# EAGLE design OpenStage (EAGLE 9.6.2)
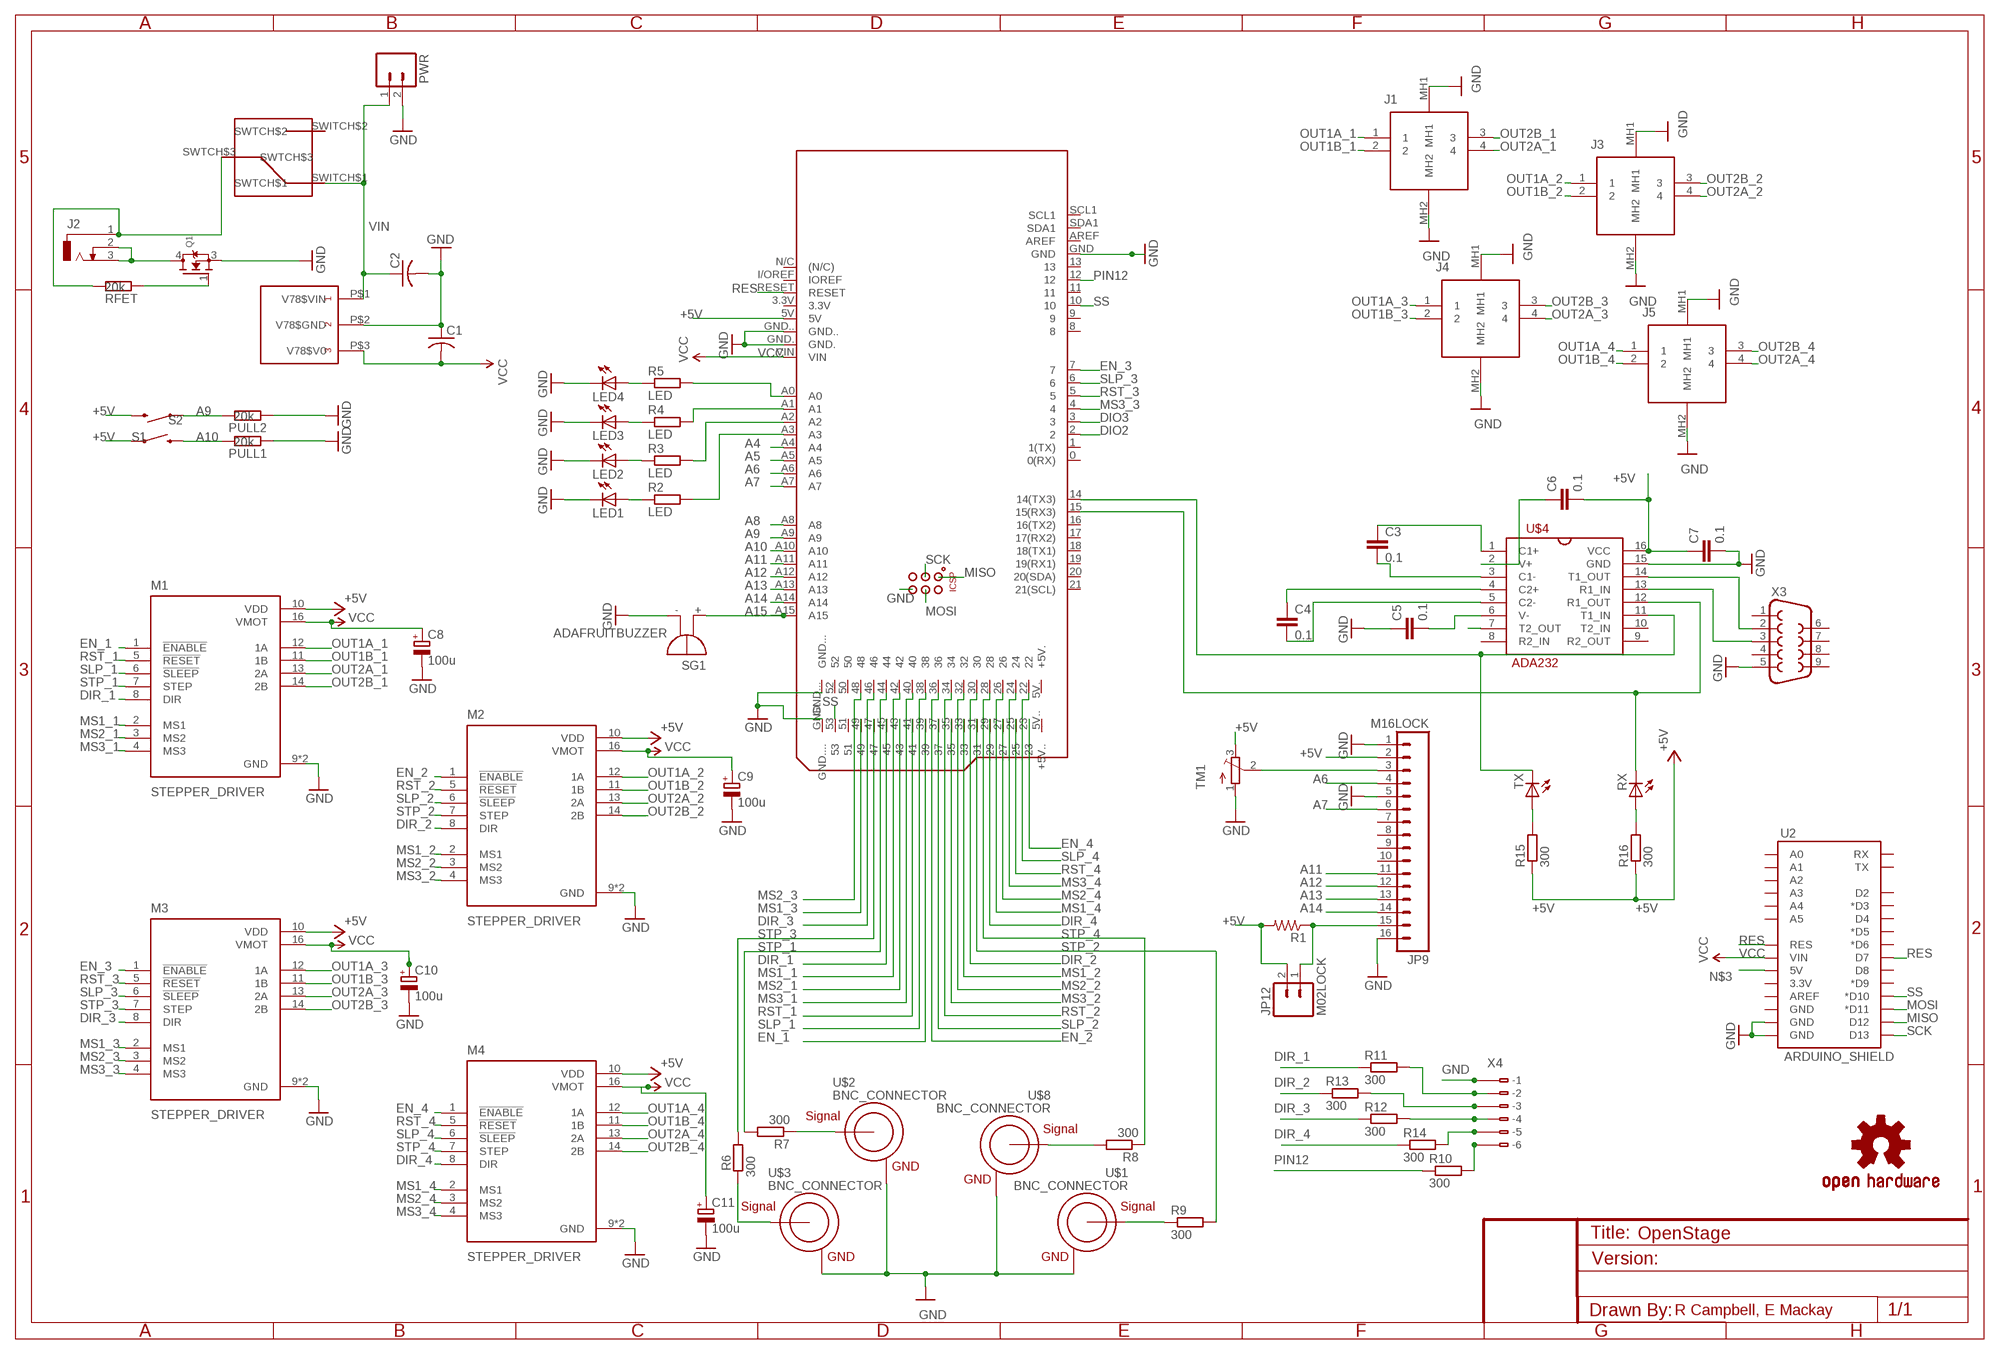
[diagram p0: schematic, sheet 1]

## Parts
C1  C-USC1210K  [C1210K]
C2  C-USC1210K  [C1210K]
C3  0.1  CAP_  [AXIAL-5MM]
C4  0.1  CAP_  [AXIAL-5MM]
C5  0.1  CAP_  [AXIAL-5MM]
C6  0.1  CAP_  [AXIAL-5MM]
C7  0.1  CAP_  [AXIAL-5MM]
C8  100u  CPOL-EUE2.5-5  [E2,5-5]
C9  100u  CPOL-EUE2.5-5  [E2,5-5]
C10  100u  CPOL-EUE2.5-5  [E2,5-5]
C11  100u  CPOL-EUE2.5-5  [E2,5-5]
J1  M8S-04PFFR-SF8001  [M8S04PFFRSF8001]
J2  DCJ0303  [DCJ0303]
J3  M8S-04PFFR-SF8001  [M8S04PFFRSF8001]
J4  M8S-04PFFR-SF8001  [M8S04PFFRSF8001]
J5  M8S-04PFFR-SF8001  [M8S04PFFRSF8001]
JP9  M16LOCK  [1X16_LOCK]
JP12  M02LOCK  [1X02_LOCK]
LED1  LED3MM  [LED3MM]
LED2  LED3MM  [LED3MM]
LED3  LED3MM  [LED3MM]
LED4  LED3MM  [LED3MM]
LOGO1  OSHW-LOGOL  [OSHW-LOGO-L]
M1  STEPPER_DRIVER  [POLOLU_CARRIER]
M2  STEPPER_DRIVER  [POLOLU_CARRIER]
M3  STEPPER_DRIVER  [POLOLU_CARRIER]
M4  STEPPER_DRIVER  [POLOLU_CARRIER]
PCB2  ARDUINO_MEGA_ROB  [ARDUINO_MEGA_ROB]
PULL1  20k  R-EU_R3216  [R3216]
PULL2  20k  R-EU_R3216  [R3216]
PWR  M02PTH  [1X02]
Q1  MOSFET-N_TO252  [TO252]
R1  R-US_0204/7  [0204/7]
R2  LED  R-EU_R3216  [R3216]
R3  LED  R-EU_R3216  [R3216]
R4  LED  R-EU_R3216  [R3216]
R5  LED  R-EU_R3216  [R3216]
R6  300  R-EU_R3216  [R3216]
R7  300  R-EU_R3216  [R3216]
R8  300  R-EU_R3216  [R3216]
R9  300  R-EU_R3216  [R3216]
R10  300  R-EU_R3216  [R3216]
R11  300  R-EU_R3216  [R3216]
R12  300  R-EU_R3216  [R3216]
R13  300  R-EU_R3216  [R3216]
R14  300  R-EU_R3216  [R3216]
R15  300  R-EU_R3216  [R3216]
R16  300  R-EU_R3216  [R3216]
RFET  20k  R-EU_R3216  [R3216]
RX  LED3MM  [LED3MM]
S1  SWITCH-MOMENTARY-212MM  [TACTILE-PTH-12MM]
S2  SWITCH-MOMENTARY-212MM  [TACTILE-PTH-12MM]
SG1  ADAFRUITBUZZER  [BMT1205XH7.5]
TM1  TRIMPOT3386  [TRIM-3386]
TX  LED3MM  [LED3MM]
U2  ARDUINO_SHIELD  ARDUINO_SHIELDNO_SILK  [DUEMILANOVE_VIAS]
U$1  BNC_CONNECTOR  [BNC_CONNECTOR]
U$2  BNC_CONNECTOR  [BNC_CONNECTOR]
U$3  BNC_CONNECTOR  [BNC_CONNECTOR]
U$4  ADA232  [DIL16]
U$5  V78XX-1000  [V78XX-1000]
U$6  SLIDING_SWITCH_0.185  [SLIDING_SWITCH_0.185]
U$8  BNC_CONNECTOR  [BNC_CONNECTOR]
X3  DB9FEMALE  [DB9]
X4  233-206  [233-206]

## Nets
+5V: C6.P$2 C7.P$1 JP9.2 JP12.2 M1.10(VDD) M2.10(VDD) M3.10(VDD) M4.10(VDD) PCB2.5V R1.2 R15.1 R16.1 S1.1 S2.3 TM1.3(E) U$4.16(VCC)
A4: PCB2.A4
A5: PCB2.A5
A6: JP9.4 PCB2.A6
A7: JP9.6 PCB2.A7
A8: PCB2.A8
A9: PCB2.A9 PULL2.2 S2.1
A10: PCB2.A10 PULL1.2 S1.3
A11: JP9.11 PCB2.A11
A12: JP9.12 PCB2.A12
A13: JP9.13 PCB2.A13
A14: JP9.14 PCB2.A14
A15: PCB2.A15 SG1.+
DIO2: PCB2.2
DIO3: PCB2.3
DIR_1: M1.8(DIR) PCB2.45 R11.1
DIR_2: M2.8(DIR) PCB2.30 R13.1
DIR_3: M3.8(DIR) PCB2.46 R12.1
DIR_4: M4.8(DIR) PCB2.29 R14.1
EN_1: M1.1(!ENABLE) PCB2.39
EN_2: M2.1(!ENABLE) PCB2.36
EN_3: M3.1(!ENABLE) PCB2.7
EN_4: M4.1(!ENABLE) PCB2.23
GND: C1.1 C2.2 C5.P$1 C7.P$2 C8.- C9.- C10.- C11.- J1.MH1 J1.MH2 J3.MH1 J3.MH2 J4.MH1 J4.MH2 J5.MH1 J5.MH2 JP9.1 JP9.5 JP9.16 LED1.K(C) LED2.K(C) LED3.K(C) LED4.K(C) M1.9(GND) M1.15(GND) M2.9(GND) M2.15(GND) M3.9(GND) M3.15(GND) M4.9(GND) M4.15(GND) PCB2.GND PCB2.GND. PCB2.GND.. PCB2.GND... PCB2.GND.... PCB2.GND__ PULL1.1 PULL2.1 PWR.2 Q1.3(S) SG1.- TM1.1(A) U2.GND@0(GND) U2.GND@1(GND) U$1.GND U$2.GND U$3.GND U$4.15(GND) U$5.P$2(V78$GND) U$8.GND X3.5 X4.B1(B-1)
MISO: PCB2.MISO U2.D12
MOSI: PCB2.MOSI U2.D11(*D11)
MS1_1: M1.2(MS1) PCB2.42
MS1_2: M2.2(MS1) PCB2.33
MS1_3: M3.2(MS1) PCB2.49
MS1_4: M4.2(MS1) PCB2.26
MS2_1: M1.3(MS2) PCB2.43
MS2_2: M2.3(MS2) PCB2.32
MS2_3: M3.3(MS2) PCB2.48
MS2_4: M4.3(MS2) PCB2.27
MS3_1: M1.4(MS3) PCB2.40
MS3_2: M2.4(MS3) PCB2.35
MS3_3: M3.4(MS3) PCB2.4
MS3_4: M4.4(MS3) PCB2.24
N$2: R7.1 U$2.SIGNAL
N$3: U2.5V
N$10: LED1.A R2.1
N$31: R9.1 U$1.SIGNAL
N$33: LED2.A R3.1
N$34: LED3.A R4.1
N$35: LED4.A R5.1
N$37: PCB2.A0 R5.2
N$38: PCB2.A1 R4.2
N$39: PCB2.A2 R3.2
N$40: PCB2.A3 R2.2
N$44: JP9.15 JP12.1 R1.1
N$60: PCB2.14(14(TX3)) TX.K(C) U$4.11(T1_IN)
N$61: PCB2.15(15(RX3)) RX.K(C) U$4.12(R1_OUT)
N$62: C3.P$1 U$4.1(C1+)
N$63: C3.P$2 U$4.3(C1-)
N$64: C4.P$1 U$4.4(C2+)
N$65: C5.P$2 U$4.6(V-)
N$66: C4.P$2 U$4.5(C2-)
N$67: C6.P$1 U$4.2(V+)
N$68: U$4.7(T2_OUT)
N$69: JP9.3 TM1.2(S)
N$70: U$4.13(R1_IN) X3.3
N$71: U$4.14(T1_OUT) X3.2
N$73: J2.1 RFET.2 U$6.SWTCH$3
N$74: R8.2 U$8.SIGNAL
N$75: R6.1 U$3.SIGNAL
N$77: R11.2 X4.A2(-2) X4.B2(B-2)
N$78: R12.2 X4.A4(-4) X4.B4(B-4)
N$79: R13.2 X4.B3(B-3)
N$80: R14.2 X4.B5(B-5)
N$81: R10.2 X4.B6(B-6)
N$82: R15.2 TX.A
N$83: R16.2 RX.A
N$84: J2.2 J2.3 Q1.4(D)
N$85: Q1.1(G) RFET.1
OUT1A_1 [thick]: J1.1 M1.12(1A)
OUT1A_2 [thick]: J3.1 M2.12(1A)
OUT1A_3 [thick]: J4.1 M3.12(1A)
OUT1A_4 [thick]: J5.1 M4.12(1A)
OUT1B_1 [thick]: J1.2 M1.11(1B)
OUT1B_2 [thick]: J3.2 M2.11(1B)
OUT1B_3 [thick]: J4.2 M3.11(1B)
OUT1B_4 [thick]: J5.2 M4.11(1B)
OUT2A_1 [thick]: J1.4 M1.13(2A)
OUT2A_2 [thick]: J3.4 M2.13(2A)
OUT2A_3 [thick]: J4.4 M3.13(2A)
OUT2A_4 [thick]: J5.4 M4.13(2A)
OUT2B_1 [thick]: J1.3 M1.14(2B)
OUT2B_2 [thick]: J3.3 M2.14(2B)
OUT2B_3 [thick]: J4.3 M3.14(2B)
OUT2B_4 [thick]: J5.3 M4.14(2B)
PIN12: PCB2.12 R10.1
RES: PCB2.RESET U2.D7 U2.RES
RST_1: M1.5(!RESET) PCB2.41
RST_2: M2.5(!RESET) PCB2.34
RST_3: M3.5(!RESET) PCB2.5
RST_4: M4.5(!RESET) PCB2.25
SCK: PCB2.SCK U2.D13
SLP_1: M1.6(!SLEEP) PCB2.38
SLP_2: M2.6(!SLEEP) PCB2.37
SLP_3: M3.6(!SLEEP) PCB2.6
SLP_4: M4.6(!SLEEP) PCB2.22
SS: PCB2.10 PCB2.53 U2.D10(*D10)
STP_1: M1.7(STEP) PCB2.44 R7.2
STP_2: M2.7(STEP) PCB2.31 R9.2
STP_3: M3.7(STEP) PCB2.47 R6.2
STP_4: M4.7(STEP) PCB2.28 R8.1
VCC [thicker]: C1.2 C8.+ C9.+ C10.+ C11.+ M1.16(VMOT) M2.16(VMOT) M3.16(VMOT) M4.16(VMOT) PCB2.VIN U2.VIN U$5.P$3(V78$V0)
VIN: C2.1 PWR.1 U$5.P$1(V78$VIN) U$6.SWITCH$1(SWTCH$1)
Unconnected: JP9.7 JP9.8 JP9.9 JP9.10 PCB2.0(0(RX)) PCB2.1(1(TX)) PCB2.3.3V PCB2.5V.(+5V.) PCB2.5V..(+5V..) PCB2.8 PCB2.9 PCB2.11 PCB2.13 PCB2.16(16(TX2)) PCB2.17(17(RX2)) PCB2.18(18(TX1)) PCB2.19(19(RX1)) PCB2.20(20(SDA)) PCB2.21(21(SCL)) PCB2.50 PCB2.51 PCB2.52 PCB2.+5V_ PCB2.AREF PCB2.I/OREF(IOREF) PCB2.N/C((N/C)) PCB2.RESET. PCB2.SCL1 PCB2.SDA1 U2.3.3V U2.A0 U2.A1 U2.A2 U2.A3 U2.A4 U2.A5 U2.AREF U2.D2 U2.D3(*D3) U2.D4 U2.D5(*D5) U2.D6(*D6) U2.D8 U2.D9(*D9) U2.GND@2(GND) U2.RX U2.TX U$4.8(R2_IN) U$4.9(R2_OUT) U$4.10(T2_IN) U$6.SWITCH$2(SWTCH$2) X3.1 X3.4 X3.6 X3.7 X3.8 X3.9 X4.A1(-1) X4.A3(-3) X4.A5(-5) X4.A6(-6)

## Notes on the sheet
- R Campbell, E Mackay

## Library data of the parts
C1 C2 = rcl:C-US: CAPACITOR, American symbol
C3-C7 = SparkFun-Passives:CAP: Capacitor Standard 0603 ceramic capacitor, and 0.1" leaded capacitor.
C8-C11 = rcl:CPOL-EU: POLARIZED CAPACITOR, European symbol; SPICEPREFIX: C
J1 J3-J5 = SamacSys_Parts:M8S-04PFFR-SF8001: AMPHENOL LTW - M8S-04PFFR-SF8001 - SENSOR CONNECTOR, M8, RCPT, 4POS Source: Datasheet <http://www.amphenolltw.com/2012download/2D PDF/03_M Series Sensor Connectors/M8S-XXPFFR-SF8001.pdf>; DESCRIPTION: AMPHENOL LTW - M8S-04PFFR-SF8001 - SENSOR CONNECTOR, M8, RCPT, 4POS; HEIGHT: 16mm; MANUFACTURER_NAME: Amphenol; MANUFACTURER_PART_NUMBER: M8S-04PFFR-SF8001; MOUSER_PART_NUMBER: 523-M8S04PFFRSF8001; MOUSER_PRICE-STOCK: https://www.mouser.co.uk/ProductDetail/Amphenol-LTW/M8S-04PFFR-SF8001?qs=Wmhir8UuqEnwzMxObWTBkA%3D%3D
J2 = ROB:DCJ0303: DC POWER JACK Source: DCJ0303.pdf; OC_FARNELL: unknown; OC_NEWARK: unknown
JP9 = SparkFun-Connectors:M16: 1x16 .1" header
JP12 = SparkFun-Connectors:M02: Standard 2-pin 0.1" header. Use with - straight break away headers ( PRT-00116) - right angle break away headers (PRT-00553) - swiss pins (PRT-00743) - machine pins (PRT-00117) - female headers (PRT-00115) Molex polarized connector foot print use with: PRT-08233 with associated crimp pins and housings. 2.54_SCREWTERM for use with PRT-10571. 3.5mm Screw Terminal footprints for PRT-08084 5mm Screw Terminal footprints for use with PRT-08433
LED1-LED4 RX TX = adafruit:LED: LED OSRAM: - CHIPLED LG R971, LG N971, LY N971, LG Q971, LY Q971, LO R971, LY R971 LH N974, LH R974 LS Q976, LO Q976, LY Q976 LO Q996 - Hyper CHIPLED LW Q18S LB Q993, LB Q99A, LB R99A - SideLED LS A670, LO A670, LY A670, LG A670, LP A670 LB A673, LV A673, LT A673, LW A673 LH A674 LY A675 LS A676, LA A676, LO A676, LY A676, LW A676 LS A679, LY A679, LG A679 - Hyper Micro SIDELED® LS Y876, LA Y876, LO Y876, LY Y876 LT Y87S - SmartLED LW L88C, LW L88S LB L89C, LB L89S, LG L890 LS L89K, LO L89K, LY L89K LS L896, LA L896, LO L896, LY L896 - TOPLED LS T670, LO T670, LY T670, LG T670, LP T670 LSG T670, LSP T670, LSY T670, LOP T670, LYG T670 LG T671, LOG T671, LSG T671 LB T673, LV T673, LT T673, LW T673 LH T674 LS T676, LA T676, LO T676, LY T676, LB T676, LH T676, LSB T676, LW T676 LB T67C, LV T67C, LT T67C, LS T67K, LO T67K, LY T67K, LW E67C LS E67B, LA E67B, LO E67B, LY E67B, LB E67C, LV E67C, LT E67C LW T67C LS T679, LY T679, LG T679 LS T770, LO T770, LY T770, LG T770, LP T770 LB T773, LV T773, LT T773, LW T773 LH T774 LS E675, LA E675, LY E675, LS T675 LS T776, LA T776, LO T776, LY T776, LB T776 LHGB T686 LT T68C, LB T68C - Hyper Mini TOPLED® LB M676 - Mini TOPLED Santana® LG M470 LS M47K, LO M47K, LY M47K Source: http://www.osram.convergy.de/
LOGO1 = SparkFun-Aesthetics:OSHW-LOGO: Open Source Hardware Logo This logo indicates the piece of hardware it is found on incorporates a OSHW license and/or adheres to the definition of open source hardware found here: http://freedomdefined.org/OSHW
M1-M4 = A4988_STEPPER_MOTOR_DRIVER_CARRIER:STEPPER_DRIVER: Stepper motor controler; IC: A4988; 1A; Uin mot: 8÷35V; AVAILABILITY: Unavailable; DESCRIPTION: Stepper Motor Driver; MF: Pololu; MP: A4988 STEPPER MOTOR DRIVER CARRIER; PACKAGE: None; PRICE: None
PCB2 = ROB:ARDUINO_MEGA_ROB: Device for representing an Arduino Mega board with a footprint in an EAGLE design. Created by Dave Young for Element14. More EAGLE documentation at: http://www.element14.com/community/community/knode/cadsoft_eagle Drill holes removed
PULL1 PULL2 R2-R16 RFET = resistor:R-EU_: RESISTOR, European symbol
PWR = SparkFun:M02: Header 2 Standard 2-pin 0.1" header. Use with straight break away headers (SKU : PRT-00116), right angle break away headers (PRT-00553), swiss pins (PRT-00743), machine pins (PRT-00117), and female headers (PRT-00115). Molex polarized connector foot print use with SKU : PRT-08233 with associated crimp pins and housings.
Q1 = ROB:MOSFET-N_TO252: N-Channel Mosfet NP90N06VLG
R1 = resistor:R-US_: RESISTOR, American symbol
S1 S2 = SparkFun-Electromechanical:SWITCH-MOMENTARY-2: Various NO switches- pushbuttons, reed, etc; PROD_ID: SWCH-09185
SG1 = ROB:ADAFRUITBUZZER: AdaFruit Buzzer TDK
TM1 = adafruit:TRIMPOT: SMT trimmer potentiometer part number TC33X http://www.ladyada.net/library/eagle
U2 = SparkFun-Boards:ARDUINO_SHIELD: Arduino shield footprint
U$1-U$3 U$8 = JoshParts:BNC_CONNECTOR
U$4 = ROB:ADA232
U$5 = ROB:V78XX-1000: V78XX-1000 non-isolated switching DC/DC voltage regulator cui.com
U$6 = ROB:SLIDING_SWITCH_0.185
X3 = SparkFun-Connectors:DB9: DB9 Connector Standard DB9 (D-Sub 9) serial connector. Can be used for CAN bus as well as RS485 and RS232. Footprint production proven. Spark Fun Electronics SKU : PRT-00429
X4 = con-wago:233-206: WAGO Cage Clamp; MPN: 233-206; OC_FARNELL: 1283536; OC_NEWARK: 28K9063

## Net classes
0 default: width 0.2 mm
1 thick: width 0.3 mm, drill 0.003 mm, clearance 0.1 mm
2 thicker: width 0.5 mm

## Board
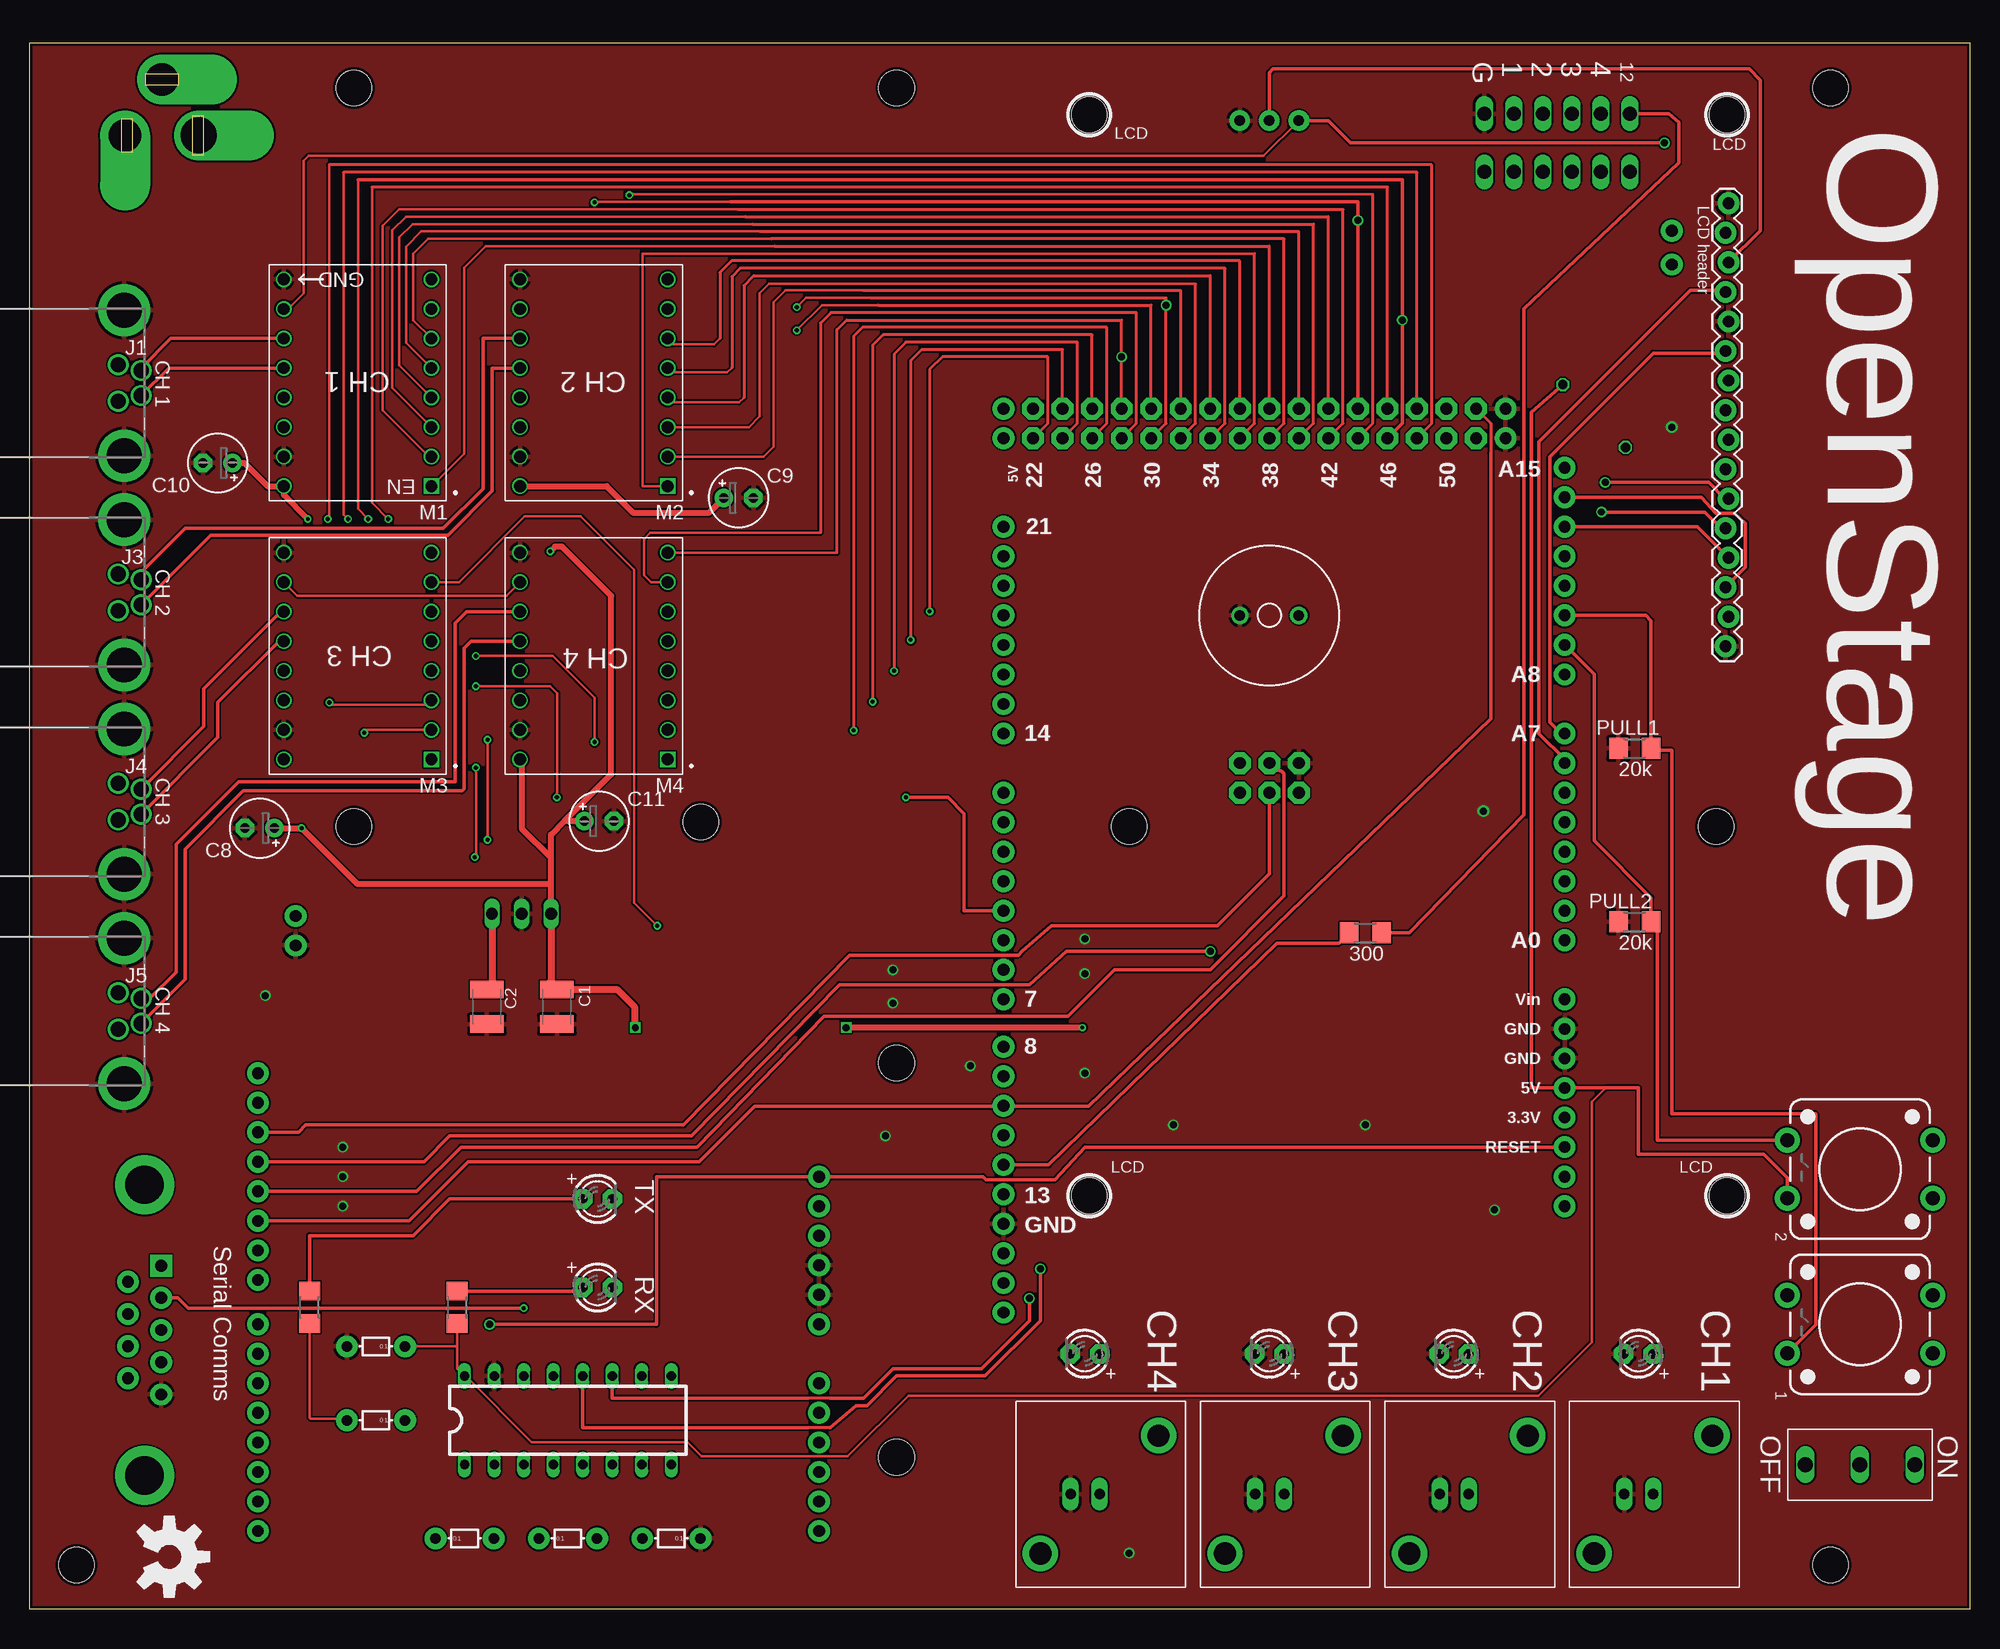
[diagram p1: board, top side]
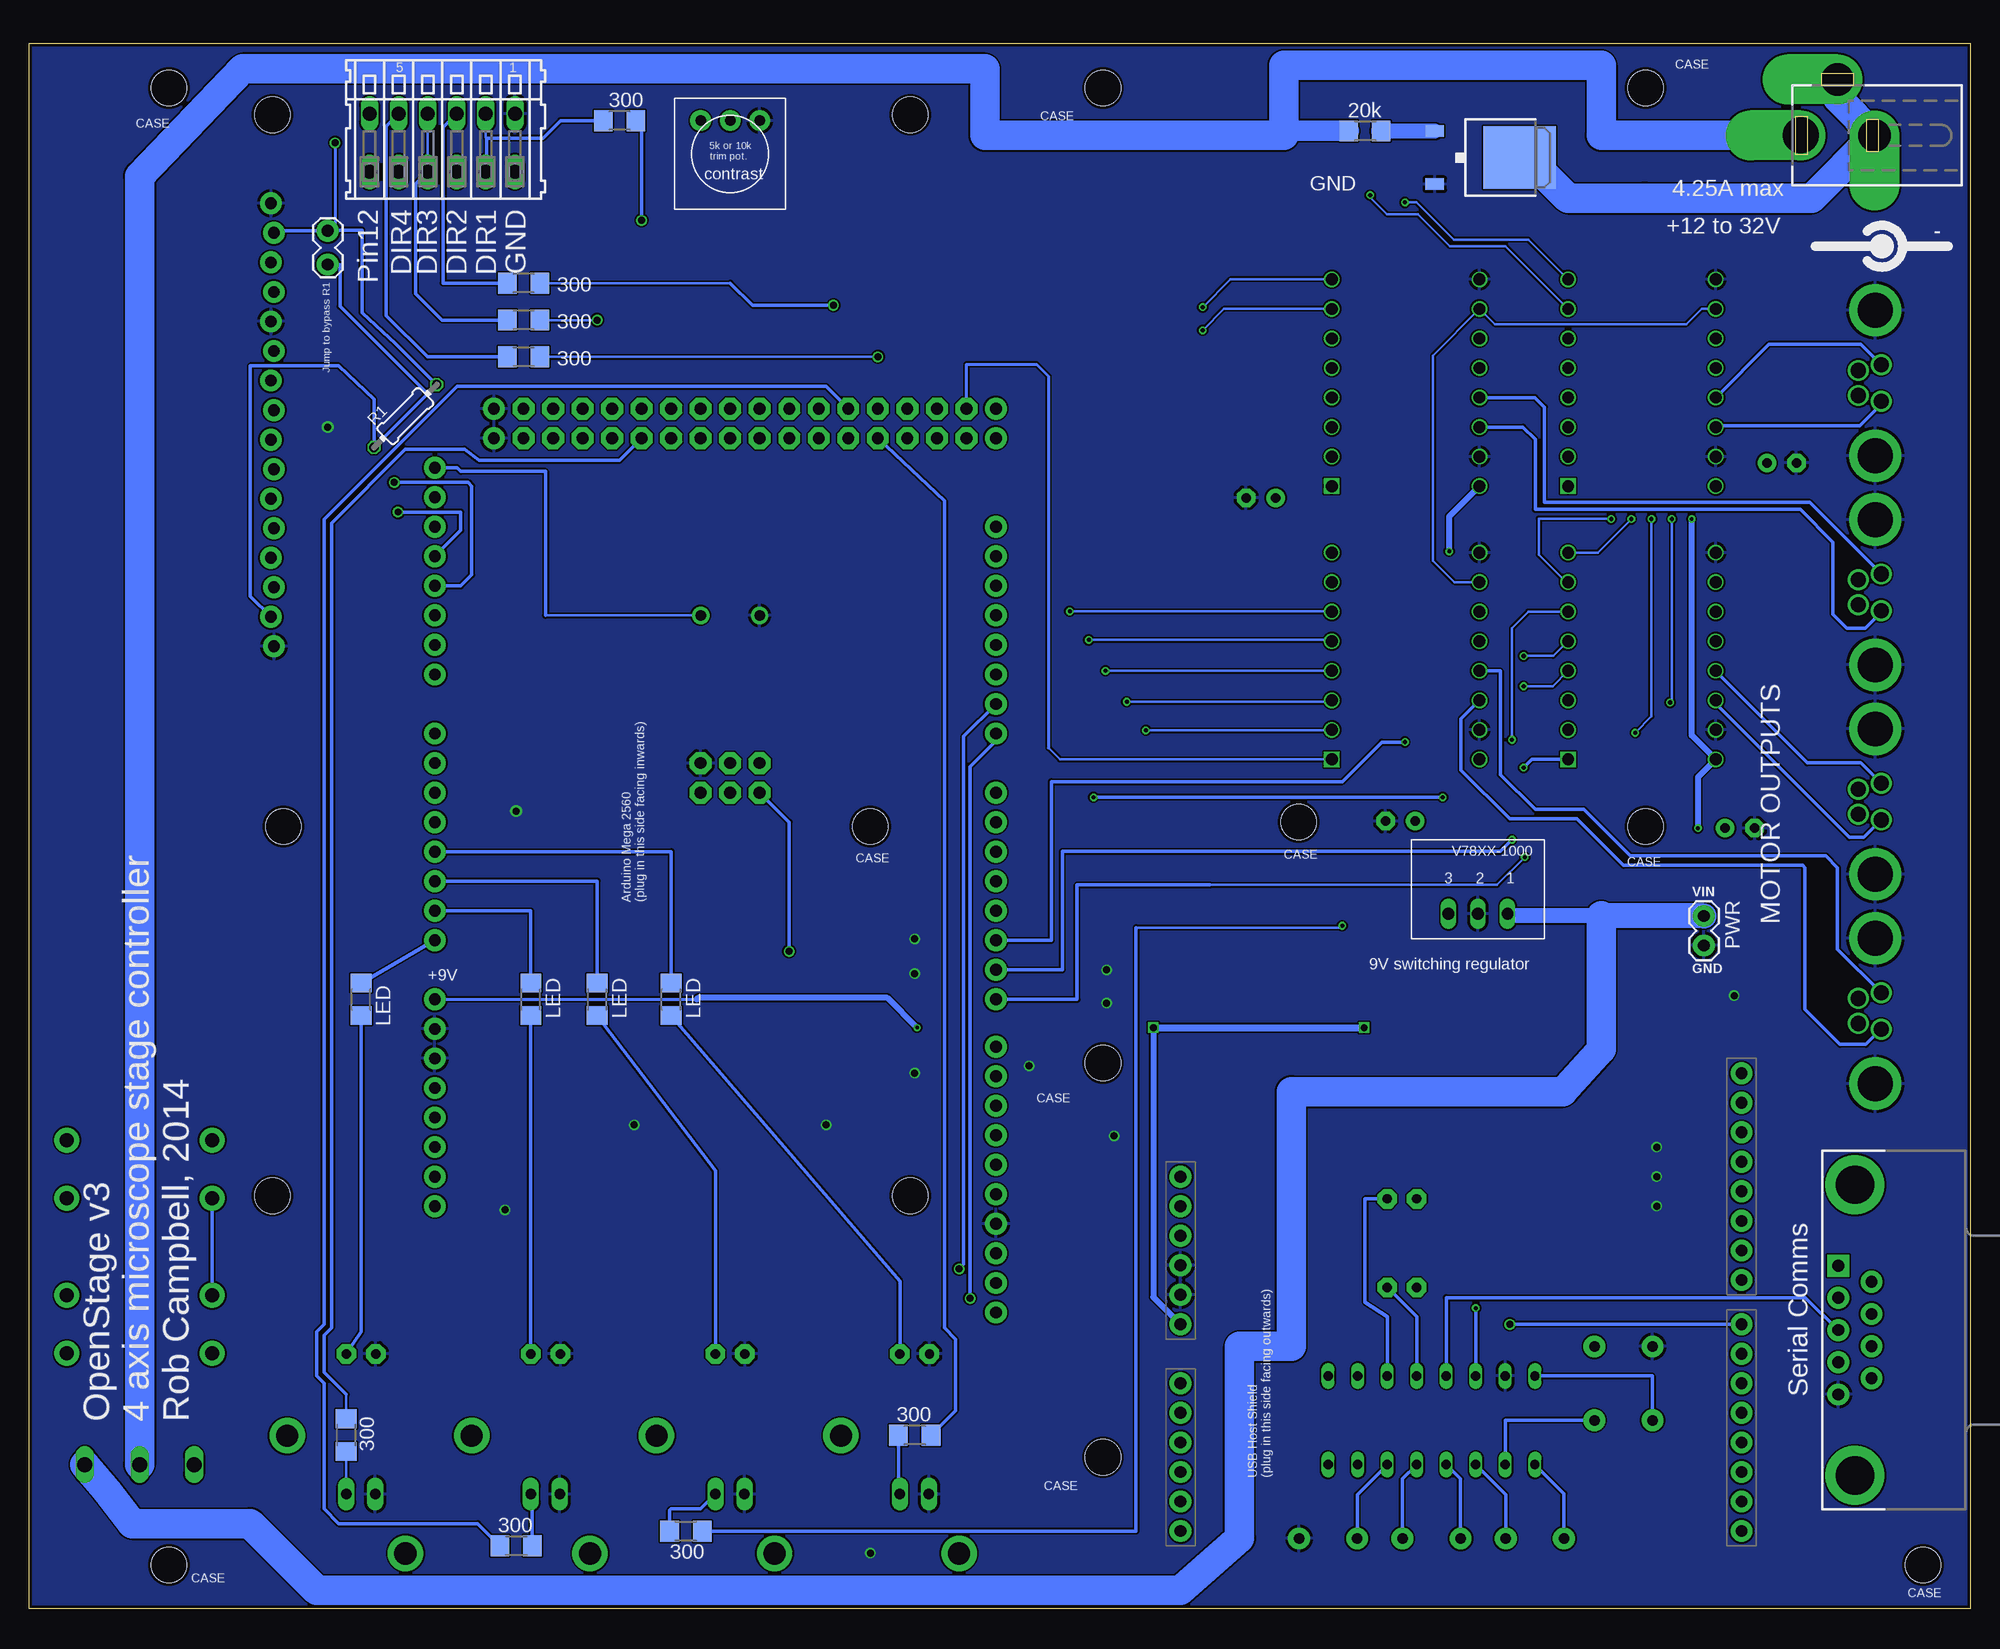
[diagram p2: board, bottom side, seen from below]

Size 166.98 x 134.61 mm. Coordinates in mm from the lower left corner, seen from the top.
Outline: 0,0 166.98,0 166.98,134.61 0,134.61 0,0
Copper layers (1*16): Top 0.035mm / dielectric 0.2mm / Bottom 0.035mm
Design rules "SeeedStudio_DRU_no_angle_20130527 *": minimum track width 6mil, minimum drill 12mil, track to track 6mil, track to pad 6mil, pad to pad 6mil, via to via 6mil, smd to smd 0mil, copper to edge 10mil, drill to drill 10mil, minimum pad ring 6mil, minimum via ring 6mil, stop-mask expansion 2mil, vias tented up to drill 25mil, thermal gap 10mil
Holes 3.05 mm at 146.05,35.5 91.19,128.46 91.19,35.5 146.05,128.46 154.94,3.75 74.61,13.02 27.94,67.25 4.06,3.75 27.94,130.75 74.61,130.75 154.94,130.75 74.61,46.93 94.62,67.25 57.78,67.63 145.1,67.25

### Footprints (pad centres in the part's own frame; a part is rotated, then mirrored left to right if it is on the bottom)
C1210K = smd 1.5 x 2.9: 1 -1.5,0; 2 1.5,0
AXIAL-5MM = drill 0.9 pad 1.88: P$1 -2.5,0; P$2 2.5,0
E2,5-5 = drill 0.813 pad 1.6: + -1.27,0 | drill 0.813 pad 1.6 octagon: - 1.27,0
M8S04PFFRSF8001 = drill 1.3 pad 1.8: 1 0,0; 2 2.15,0; 3 -0.5,1.95; 4 2.65,1.95 | drill 3 pad 4.5: MH1 -5.175,1.45; MH2 7.325,1.45
DCJ0303 = drill 3.099 pad 4.318 offset: 1 0,3.175 | drill 2.794 pad 4.318 offset: 2 4.826,0; 3 0,-3.175
1X16_LOCK = drill 1.016 pad 1.88: 1 0,0.127; 2 2.54,-0.127; 3 5.08,0.127; 4 7.62,-0.127; 5 10.16,0.127; 6 12.7,-0.127; 7 15.24,0.127; 8 17.78,-0.127; 9 20.32,0.127; 10 22.86,-0.127; 11 25.4,0.127; 12 27.94,-0.127; 13 30.48,0.127; 14 33.02,-0.127; 15 35.56,0.127; 16 38.1,-0.127
1X02_LOCK = drill 1.016 pad 1.88: 1 -0.178,0; 2 2.718,0
LED3MM = drill 0.813 pad 1.676 octagon: A -1.27,0; K 1.27,0
POLOLU_CARRIER = drill 1.02 square: 1 -6.35,8.89 | drill 1.02: 2 -6.35,6.35; 3 -6.35,3.81; 4 -6.35,1.27; 5 -6.35,-1.27; 6 -6.35,-3.81; 7 -6.35,-6.35; 8 -6.35,-8.89; 9 6.35,-8.89; 10 6.35,-6.35; 11 6.35,-3.81; 12 6.35,-1.27; 13 6.35,1.27; 14 6.35,3.81; 15 6.35,6.35; 16 6.35,8.89
ARDUINO_MEGA_ROB = drill 1.016 pad 1.88: 0 63.5,50.8; 1 60.96,50.8; 2 58.42,50.8; 3 55.88,50.8; 3.3V 35.56,2.54; 4 53.34,50.8; 5 50.8,50.8; 5V 38.1,2.54; 5V. 93.98,50.8; 5V.. 96.52,50.8; 6 48.26,50.8; 7 45.72,50.8; 8 41.656,50.8; 9 39.116,50.8; 10 36.576,50.8; 11 34.036,50.8; 12 31.496,50.8; 13 28.956,50.8; 14 68.58,50.8; 15 71.12,50.8; 16 73.66,50.8; 17 76.2,50.8; 18 78.74,50.8; 19 81.28,50.8; 20 83.82,50.8; 21 86.36,50.8; A0 50.8,2.54; A1 53.34,2.54; A2 55.88,2.54; A3 58.42,2.54; A4 60.96,2.54; A5 63.5,2.54; A6 66.04,2.54; A7 68.58,2.54; A8 73.66,2.54; A9 76.2,2.54; A10 78.74,2.54; A11 81.28,2.54; A12 83.82,2.54; A13 86.36,2.54; A14 88.9,2.54; A15 91.44,2.54; AREF 23.876,50.8; GND 26.416,50.8; GND. 43.18,2.54; GND.. 40.64,2.54; GND... 93.98,7.62; GND.... 96.52,7.62; I/OREF 30.48,2.54; N/C 27.94,2.54; RESET 33.02,2.54; SCL1 18.796,50.8; SDA1 21.336,50.8; VIN 45.72,2.54 | drill 1.016 pad 1.88 octagon: 22 93.98,48.26; 23 96.52,48.26; 24 93.98,45.72; 25 96.52,45.72; 26 93.98,43.18; 27 96.52,43.18; 28 93.98,40.64; 29 96.52,40.64; 30 93.98,38.1; 31 96.52,38.1; 32 93.98,35.56; 33 96.52,35.56; 34 93.98,33.02; 35 96.52,33.02; 36 93.98,30.48; 37 96.52,30.48; 38 93.98,27.94; 39 96.52,27.94; 40 93.98,25.4; 41 96.52,25.4; 42 93.98,22.86; 43 96.52,22.86; 44 93.98,20.32; 45 96.52,20.32; 46 93.98,17.78; 47 96.52,17.78; 48 93.98,15.24; 49 96.52,15.24; 50 93.98,12.7; 51 96.52,12.7; 52 93.98,10.16; 53 96.52,10.16; +5V_ 66.04,30.48; GND__ 66.04,25.4; MISO 63.5,30.48; MOSI 66.04,27.94; RESET. 63.5,25.4; SCK 63.5,27.94
R3216 = smd 1.6 x 1.8: 1 -1.4,0; 2 1.4,0
1X02 = drill 1.016 pad 1.88: 1 0,0; 2 2.54,0
TO252 = smd 1 x 1.6: 1 -2.28,-4.8; 3 2.28,-4.8 | smd 5.4 x 6.2: 4 0,2.5
0204/7 = drill 0.813 octagon: 1 -3.81,0; 2 3.81,0
TACTILE-PTH-12MM = drill 1.2 pad 2.159: 1 6.25,-2.5; 2 -6.25,-2.5; 3 6.25,2.5; 4 -6.25,2.5
BMT1205XH7.5 = drill 0.9 pad 1.5: + 2.53,0; - -2.53,0
TRIM-3386 = drill 0.9 pad 1.778: 1 -2.54,-2.857; 2 0,-2.857; 3 2.54,-2.857
DUEMILANOVE_VIAS = drill 1.016 pad 1.88: 3.3V 50.8,13.97; 5V 50.8,16.51; A0 50.8,29.21; A1 50.8,31.75; A2 50.8,34.29; A3 50.8,36.83; A4 50.8,39.37; A5 50.8,41.91; AREF 2.54,2.54; D2 2.54,36.83; D3 2.54,34.29; D4 2.54,31.75; D5 2.54,29.21; D6 2.54,26.67; D7 2.54,24.13; D8 2.54,20.32; D9 2.54,17.78; D10 2.54,15.24; D11 2.54,12.7; D12 2.54,10.16; D13 2.54,7.62; GND@0 50.8,19.05; GND@1 50.8,21.59; GND@2 2.54,5.08; RES 50.8,11.43; RX 2.54,41.91; TX 2.54,39.37; VIN 50.8,24.13
BNC_CONNECTOR = drill 0.9 pad 1.422 long: GND -2.492,0; SIGNAL 0,0 | drill 1.9 pad 3.048: P$3 5.076,5.025; P$4 -5.089,-5.102
DIL16 = drill 0.813 long: 1 -8.89,-3.81; 2 -6.35,-3.81; 3 -3.81,-3.81; 4 -1.27,-3.81; 5 1.27,-3.81; 6 3.81,-3.81; 7 6.35,-3.81; 8 8.89,-3.81; 9 8.89,3.81; 10 6.35,3.81; 11 3.81,3.81; 12 1.27,3.81; 13 -1.27,3.81; 14 -3.81,3.81; 15 -6.35,3.81; 16 -8.89,3.81
V78XX-1000 = drill 1.016 long: P$1 3.302,6.604; P$2 5.842,6.604; P$3 8.382,6.604
SLIDING_SWITCH_0.185 = drill 1.295 long: SWITCH$1 -4.699,0; SWITCH$2 4.699,0; SWTCH$3 0,0
DB9 = drill 1.016 pad 1.88 square: 1 -5.54,-1.42 | drill 1.016 pad 1.88: 2 -2.77,-1.42; 3 0,-1.42; 4 2.77,-1.42; 5 5.54,-1.42; 6 -4.15,1.42; 7 -1.38,1.42; 8 1.38,1.42; 9 4.15,1.42 | drill 3.302 pad 5.08: G1 -12.5,0; G2 12.5,0
233-206 = drill 1.2 long: A1 -6.25,2.5; A2 -3.75,2.5; A3 -1.25,2.5; A4 1.25,2.5; A5 3.75,2.5; A6 6.25,2.5; B1 -6.25,-2.5; B2 -3.75,-2.5; B3 -1.25,-2.5; B4 1.25,-2.5; B5 3.75,-2.5; B6 6.25,-2.5

### Placement (x,y rotation side)
C1  45.4,51.75 90 top
C2  39.37,51.75 270 top
C3  37.46,6.03 0 top
C4  46.35,6.03 0 top
C5  55.24,6.03 180 top
C6  29.85,16.19 180 top
C7  29.85,22.54 180 top
C8  19.84,67.12 180 top
C9  61.03,95.52 0 top
C10  16.23,98.52 180 top
C11  49.03,67.72 0 top
J1  9.63,104.32 90 top
J2  11.43,126.68 90 bottom
J3  9.63,86.32 90 top
J4  9.63,68.32 90 top
J5  9.63,50.32 90 top
JP9  146.05,120.84 270 top
JP12  141.29,115.76 90 bottom
LED1  90.81,21.91 180 top
LED2  106.68,21.91 180 top
LED3  122.56,21.91 180 top
LED4  138.43,21.91 180 top
LOGO1  12.06,4.45 270 top
M1  28.26,105.41 180 top
M2  48.58,105.41 180 top
M3  28.26,81.91 180 top
M4  48.58,81.91 180 top
PCB2  134.62,6.67 90 top
PULL1  138.11,73.98 0 top
PULL2  138.11,59.05 0 top
PWR  22.92,59.56 270 bottom
Q1  41.27,124.78 270 bottom
R1  134.62,102.55 45 bottom
R2  111.76,52.39 90 bottom
R3  118.11,52.39 90 bottom
R4  123.83,52.39 90 bottom
R5  138.43,52.39 90 bottom
R6  110.49,6.67 0 bottom
R7  139.7,14.92 90 bottom
R8  90.81,14.92 180 bottom
R9  125.09,5.4 180 bottom
R10  114.94,58.1 0 top
R11  116.2,127.95 180 bottom
R12  124.46,110.81 180 bottom
R13  124.46,113.98 180 bottom
R14  124.46,107.63 180 bottom
R15  24.13,25.91 90 top
R16  36.83,25.91 90 top
RFET  52.07,127.06 180 bottom
RX  48.89,27.62 0 top
S1  157.48,24.45 180 top
S2  157.48,37.78 180 top
SG1  106.68,85.41 0 top
TM1  106.68,125.09 180 bottom
TX  48.89,35.24 0 top
U2  17.15,48.58 180 bottom
U$1  123.83,9.84 0 top
U$2  139.7,9.84 0 top
U$3  107.95,9.84 0 top
U$4  46.35,16.19 0 top
U$5  36.51,66.36 180 bottom
U$6  157.48,12.38 180 top
U$8  92.08,9.84 0 top
X3  9.93,23.95 270 bottom
X4  131.44,126.05 180 bottom

### Tracks (layer width: path | path; a pad name or v marks a point on that pad's centre or on a via)
+5V  (via drill 0.6)
  Top 0.2: TM1.3 106.19,124.92 24.04,124.92 23.64,124.52 23.64,113.12 22.28,111.76 M1.10 | M3.10 23.06,87.12 41.08,87.12 M4.10 | 135.63,44.77 134.44,43.57 134.44,22.92 129.83,18.32 75.64,18.32 70.41,13.1 67.45,13.1 67.43,13.12 57.84,13.12 56.63,14.32 43.23,14.32 37.55,20 U$4.16 36.83,20.64 36.83,22.52 | C6.P$2 27.22,16.32 24.24,16.32 24.13,16.42 R15.1 | 36.83,22.52 R16.1 | C7.P$1 36.8,22.54 36.83,22.52
  Top 0.3: 129.22,44.77 PCB2.5V 135.63,44.77 138.43,44.77
  Top 0.305: 129.22,44.77 129.22,102.87 R1.2 | S2.3 151.23,37.05 149.22,39.05 138.43,39.05 138.43,44.77 | TM1.3 111.76,127.95 113.67,126.05 v140.67,126.05
  Bottom 0.2: M1.10 23.11,111.76 24.43,110.45 40.91,110.45 M2.10 46.23,107.75 46.23,90.12 44.38,88.27 M4.10
  Bottom 0.254: v140.67,126.05 140.64,126.02 140.64,118.74 140.64,118.55
  Bottom 0.305: S1.1 S2.3 | R1.2 135.45,108.78 138.34,111.44 138.34,118.55 140.64,118.55 | 140.64,118.74 141.02,118.74 JP12.2 145.75,118.48 JP9.2 | U$4.16 27.36,20 C6.P$2
A6
  Top 0.305: PCB2.A6 132.08,73.02 129.86,75.25 129.86,100.33 142.88,113.35 145.8,113.35 JP9.4
A7
  Top 0.305: PCB2.A7 131.76,75.25 130.81,76.2 130.81,99.06 139.7,107.95 145.73,107.95 JP9.6
A9
  Top 0.305: S2.1 140.06,40.28 140.06,58.51 PULL2.2 139.51,61.15 134.62,66.04 134.62,80.33 PCB2.A9
A10
  Top 0.305: PCB2.A10 139.06,85.41 139.51,84.96 PULL1.2 139.7,73.79 141.29,73.79 141.29,42.54 153.67,42.54 153.67,24.39 S1.3
A11  (via drill 0.6)
  Top 0.305: JP9.11 145.86,95.44 144.46,96.84 v135.57,96.84
  Bottom 0.305: PCB2.A11 129.86,87.95 128.91,88.9 128.91,96.52 129.22,96.84 v135.57,96.84
A12  (via drill 0.6)
  Top 0.305: JP9.12 145.54,92.9 144.14,94.3 v135.25,94.3
  Bottom 0.305: PCB2.A12 129.86,92.71 129.86,94.3 v135.25,94.3
A13
  Top 0.305: PCB2.A13 143.51,93.03 JP9.13
A14
  Top 0.305: PCB2.A14 143.83,95.57 145.1,94.17 146.69,94.17 147.64,93.35 147.64,89.54 JP9.14
A15
  Bottom 0.2: 122.56,85.41 SG1.+
  Bottom 0.305: 122.56,85.41 122.56,97.79 129.86,97.79 130.17,98.11 PCB2.A15
DIR_1  (via drill 0.35, 0.6)
  Top 0.2: v48.63,120.92 48.68,120.97 60.32,120.97
  Top 0.305: PCB2.45 v114.3,119.38 114.3,120.97 60.32,120.97
  Bottom 0.2: M1.8 38.02,117.72 44.43,117.72 47.63,120.92 v48.63,120.92 | R11.1 114.3,127.95
  Bottom 0.305: 114.3,127.95 v114.3,119.38
DIR_2  (via drill 0.35, 0.6)
  Top 0.2: v66.04,111.92 66.83,112.71 72.39,112.71
  Top 0.254: PCB2.30 97.79,101.92 v97.79,112.08 97.79,112.71 72.39,112.71
  Bottom 0.2: M2.8 63.65,114.3 v66.04,111.92 | R13.1 106.68,113.98
  Bottom 0.305: 106.68,113.98 104.78,112.08 v97.79,112.08
DIR_3  (via drill 0.35, 0.6)
  Top 0.2: 28.31,122.87 28.31,94.56 v29.17,93.7
  Top 0.305: PCB2.46 118.11,101.92 v118.11,110.81 118.11,122.87 28.31,122.87
  Bottom 0.2: v29.17,93.7 32.06,90.8 M3.8 | R12.1 v118.11,110.81
DIR_4  (via drill 0.6)
  Top 0.2: M4.8 69.5,90.8
  Top 0.254: PCB2.29 v93.98,107.63 93.98,110.81 70.33,110.81 69.5,109.98 69.5,90.8
  Bottom 0.2: R14.1 v93.98,107.63
EN_1
  Top 0.2: 64.14,117.16 39.27,117.16 37.41,115.29 37.41,99.32 M1.1
  Top 0.254: PCB2.39 106.68,117.16 64.14,117.16
EN_2
  Top 0.2: 105.41,116.52 52.79,116.52 52.79,96.52 M2.1
  Top 0.254: PCB2.36 105.41,101.92 105.41,116.52
EN_3  (via drill 0.35)
  Top 0.2: v38.43,72.32 38.43,64.72 v38.34,64.62
  Bottom 0.2: 65.41,62.23 40.72,62.23 v38.34,64.62
  Bottom 0.3: M3.1 37.73,73.02 v38.43,72.32
  Bottom 0.305: PCB2.7 76.84,52.39 76.84,62.23 65.41,62.23
EN_4
  Bottom 0.2: 79.31,74.02 78.31,73.02 M4.1
  Bottom 0.254: PCB2.23 86.36,107 80.32,107 79.31,105.99 79.31,74.02
GND  (via drill 0.6, 0.6 pad 1.02)
  other vias: 126.05,34.29 114.94,41.59 98.43,41.59 125.09,68.58 73.66,40.64 74.3,54.93 90.81,54.61 26.99,39.69 26.99,37.15 20.32,52.71 80.96,46.67 90.81,46.04 90.81,57.59 26.99,34.61 94.62,4.76 141.29,101.6 74.3,52.07
  pour Top: 147.95,134.94 -1.27,135.25 -0.95,-1.91 167,-1.59 167.64,135.57
  pour Bottom: -0.64,134.94 -1.59,-1.59 167.64,-0.95 167.64,134.62
MISO  (via drill 0.6)
  Top 0.305: U2.D12 33.97,38.42 36.2,40.64 57,40.64 69.7,53.66 86.04,53.66 89.22,56.51 v101.6,56.51
  Bottom 0.305: v101.6,56.51 101.6,67.63 PCB2.MISO
MOSI
  Top 0.305: U2.D11 33.34,35.88 37.15,39.69 57.47,39.69 68.4,50.93 89.34,50.93 93.34,54.93 101.6,54.93 107.95,61.28 107.95,71.62 arc90 107.5,72.07 107.32,72.07 PCB2.MOSI
MS1_1
  Top 0.2: M1.2 34.41,99.06 30.44,103.03 30.44,118.92 31.85,120.33 60.96,120.33
  Top 0.254: PCB2.42 113.03,101.92 113.03,120.33 60.96,120.33
MS1_2
  Top 0.2: M2.2 63.18,99.06 64.03,99.92 64.03,112.32 65.07,113.35 71.76,113.35
  Top 0.254: PCB2.33 99.06,113.35 71.76,113.35
MS1_3  (via drill 0.35)
  Top 0.2: v27.43,93.7 27.06,94.07 27.06,123.51 | v28.84,75.32 29.08,75.57 M3.2
  Top 0.254: PCB2.49 119.38,123.51 27.06,123.51
  Bottom 0.2: v28.84,75.32 27.43,76.72 v27.43,93.7
MS1_4  (via drill 0.35)
  Top 0.254: PCB2.26 92.71,101.92 92.71,110.17 71.69,110.17 70.93,109.41 v70.93,75.52
  Bottom 0.2: M4.2 54.98,75.52 v70.93,75.52
MS2_1
  Top 0.2: M1.3 31.24,104.97 31.24,118.52 32.41,119.7 61.59,119.7
  Top 0.254: PCB2.43 111.76,119.7 61.59,119.7
MS2_2
  Top 0.2: M2.3 61.92,101.6 62.84,102.52 62.84,113.12 63.63,113.92 100.33,113.92
  Top 0.254: PCB2.32 100.33,101.92 100.33,113.92
MS2_3  (via drill 0.35)
  Top 0.2: 25.82,124.14 25.82,93.83 v25.69,93.7 | v25.84,77.92 26.04,77.72 34.22,77.72 M3.3
  Top 0.254: PCB2.48 120.65,101.92 120.65,124.14 25.82,124.14
  Bottom 0.2: v25.69,93.7 25.69,78.06 v25.84,77.92
MS2_4  (via drill 0.35)
  Top 0.2: 72.57,78.12 v72.57,77.98
  Top 0.254: PCB2.27 91.44,109.54 73.45,109.54 72.57,108.65 72.57,78.12
  Bottom 0.2: v72.57,77.98 54.93,77.98 M4.3
MS3_1
  Top 0.2: M1.4 31.84,106.91 31.84,117.92 32.98,119.06 62.23,119.06
  Top 0.254: PCB2.40 110.49,101.92 110.49,119.06 62.23,119.06
MS3_2
  Top 0.2: 61.48,104.14 61.06,103.72 55.35,103.72 M2.4
  Top 0.254: PCB2.35 101.6,114.62 62.34,114.62 61.48,113.77 61.48,104.14
MS3_3  (via drill 0.35)
  Top 0.2: v38.43,79.32 44.84,79.32 45.43,78.72 45.43,69.79 v45.4,69.76
  Top 0.3: 80.41,68.37 79.02,69.76 v75.42,69.76
  Top 0.305: PCB2.4 80.41,60.01 80.41,68.37
  Bottom 0.2: v38.43,79.32 35.93,79.32 M3.4
  Bottom 0.3: v45.4,69.76 v75.42,69.76
MS3_4  (via drill 0.35)
  Top 0.254: PCB2.24 90.17,101.92 90.17,108.9 75.42,108.9 74.4,107.88 v74.4,80.64
  Bottom 0.2: v74.4,80.64 M4.4
N$2
  Bottom 0.2: R7.1 U$2.SIGNAL
N$10
  Bottom 0.305: LED1.A 92.08,28.13 R2.1
N$31
  Bottom 0.305: R9.1 123.7,9.71 U$1.SIGNAL
N$33
  Bottom 0.305: LED2.A 107.95,37.66 R3.1
N$34
  Bottom 0.305: LED3.A R4.1
N$35
  Bottom 0.305: R5.1 138.43,23.81 LED4.A
N$37
  Bottom 0.305: PCB2.A0 R5.2
N$38
  Bottom 0.305: PCB2.A1 123.83,60.01 R4.2
N$39
  Bottom 0.305: R3.2 118.11,62.55 PCB2.A2
N$40
  Bottom 0.305: PCB2.A3 111.76,65.09 R2.2
N$44
  Bottom 0.305: JP9.15 147.95,87.06 147.95,106.87 140.33,106.87 137.31,103.98 R1.1 132.72,104.46 140.24,111.99 140.24,115.57 141.27,115.57 JP12.1
N$60  (via drill 0.6)
  Top 0.254: 68.9,18.1 66.99,18.1
  Top 0.305: 68.9,18.1 71.76,18.1 74.3,20.64 81.92,20.64 86.04,24.77 v86.04,26.67 | 66.99,18.1 50.16,18.1 U$4.11
  Bottom 0.305: 83.82,74.61 86.04,72.39 v86.04,26.67 | TX.K 52.07,35.24 52.07,26.35 50.16,25.08 U$4.11
  Bottom 0.406: PCB2.14 83.82,74.61
N$61  (via drill 0.6)
  Top 0.254: 68.9,15.56 66.99,15.56
  Top 0.305: 68.9,15.56 71.12,17.46 72.07,17.46 74.61,20 82.23,20 87,24.77 v87,29.21 | 66.99,15.56 47.62,15.56 U$4.12
  Bottom 0.305: PCB2.15 86.59,75.01 86.59,29.61 v87,29.21 | RX.K 47.62,25.08 U$4.12
N$62
  Bottom 0.305: C3.P$1 34.96,9.88 U$4.1
N$63
  Bottom 0.305: C3.P$2 39.96,9.8 U$4.3
N$64
  Bottom 0.305: C4.P$1 43.85,11.15 U$4.4
N$65
  Bottom 0.305: C5.P$2 52.74,9.8 U$4.6
N$66
  Bottom 0.305: C4.P$2 48.85,11.15 U$4.5
N$67
  Bottom 0.305: C6.P$1 40,16.19 U$4.2
N$69
  Top 0.305: TM1.2 106.68,132.08 107,132.4 147.95,132.4 148.91,131.44 148.91,118.49 JP9.3
N$70
  Bottom 0.305: U$4.13 45.09,26.73 14.21,26.73 X3.3
N$71  (via drill 0.35)
  Top 0.305: v42.54,25.84 13.7,25.84 12.77,26.72 X3.2
  Bottom 0.305: v42.54,25.84 U$4.14
N$73
  Bottom 0.61: 58.04,127.06 58.1,127 59.05,127
  Bottom 1.778: RFET.2 58.04,127.06
  Bottom 2.54: U$6.SWTCH$3 157.48,123.19 148.59,132.4 84.77,132.4 84.77,126.68 59.05,126.68 59.05,127 59.05,132.72 31.75,132.72 31.75,126.68 J2.1
N$74
  Bottom 0.305: R8.2 92.2,9.97 U$8.SIGNAL
N$75
  Bottom 0.305: R6.1 111.89,8.44 111.76,8.57 109.22,8.57 U$3.SIGNAL
N$77
  Bottom 0.2: X4.B2 127.7,126.51 127.64,126.45
  Bottom 0.305: R11.2 121.29,127.95 122.79,126.45 127.64,126.45 127.64,123.61 X4.A2
N$78
  Bottom 0.2: X4.B4 X4.A4
  Bottom 0.305: R12.2 131.44,110.81 133.72,113.08 133.72,122.53 X4.A4
N$79
  Bottom 0.305: R13.2 131.38,113.98 131.38,127.37 X4.B3
N$80
  Bottom 0.305: R14.2 132.72,107.63 136.25,111.17 136.25,127.49 X4.B5
N$81
  Top 0.305: R10.2 118.75,58.1 128.59,68.26 128.59,111.76 141.9,124.31 141.9,127.82 141.03,128.55 X4.B6
N$82
  Top 0.305: R15.2 24.13,32.07 33.02,32.07 36.2,35.24 TX.A
N$83
  Top 0.305: R16.2 47.31,27.31 RX.A
N$84
  Bottom 2.54: J2.2 11.43,129.86 J2.3 13.65,121.29 28.04,121.29 34.61,121.29 38.1,124.78 Q1.4
N$85
  Bottom 1.27: Q1.1 RFET.1
  Bottom 1.778: RFET.1
OUT1A_1
  Top 0.3: M1.12 12,106.68 J1.1
OUT1A_2
  Top 0.3: J3.1 15.63,92.32 36.03,92.32 39.84,96.12 39.84,106.68 M2.12
OUT1A_3
  Top 0.3: J4.1 16.23,74.92 16.23,77.92 21.5,83.19 M3.12
OUT1A_4
  Top 0.3: M4.12 38.03,83.19 37.43,82.59 37.43,70.52 37.23,70.32 18.44,70.32 13.44,65.32 13.44,54.12 J5.1
OUT1B_1
  Top 0.3: M1.11 12.19,109.22 9.63,106.67 J1.2
OUT1B_2
  Top 0.3: M2.11 39.03,109.22 39.03,96.32 35.63,92.92 13.44,92.92 9.63,89.12 J3.2
OUT1B_3
  Top 0.3: J4.2 15.04,75.87 15.04,79.12 21.64,85.72 M3.11
OUT1B_4
  Top 0.3: M4.11 37.63,85.72 36.63,84.73 36.63,71.12 18.04,71.12 12.63,65.72 12.63,54.72 10.38,52.47 J5.2
OUT2A_1
  Bottom 0.3: J1.4 9.44,108.72 17.33,108.72 M1.13
OUT2A_2
  Bottom 0.3: M2.13 37.46,104.14 36.63,103.32 36.63,95.12 13.83,95.12 J3.4
OUT2A_3
  Bottom 0.3: J4.4 9.44,72.72 14.04,72.72 21.91,80.59 M3.13
OUT2A_4
  Bottom 0.3: M4.13 40.43,80.65 40.43,71.72 37.43,68.72 33.23,68.72 29.24,64.72 12.44,64.72 11.44,63.72 11.44,56.72 J5.4
OUT2B_1
  Bottom 0.3: J1.3 7.68,103.57 9.54,101.72 21.79,101.72 M1.14
OUT2B_2
  Bottom 0.3: J3.3 7.68,85.67 9.04,84.32 10.63,84.32 11.83,85.52 11.83,91.72 14.63,94.52 37.43,94.52 37.43,100.55 38.49,101.6 M2.14
OUT2B_3
  Bottom 0.3: J4.3 9.19,66.32 10.44,66.32 21.91,77.79 M3.14
OUT2B_4
  Bottom 0.3: J5.3 8.98,48.52 11.23,48.52 14.23,51.52 14.23,63.72 14.44,63.92 29.84,63.92 33.84,67.92 39.63,67.92 43.83,72.11 43.83,76.51 M4.14
PIN12
  Top 0.305: PCB2.12 87.69,38.16 107.32,57.21 112.65,57.21 R10.1
RES  (via drill 0.6)
  Top 0.305: PCB2.RESET 90.81,39.69 88.27,36.89 82.3,36.89 82.04,37.15 U2.RES 53.98,37.15 53.98,24.45 v39.61,24.45
  Bottom 0.305: U2.D7 v39.61,24.45
RST_1
  Top 0.2: M1.5 32.44,108.85 32.44,117.12 33.74,118.43 62.86,118.43
  Top 0.254: PCB2.41 109.22,118.43 62.86,118.43
RST_2
  Top 0.2: M2.5 54.93,106.32 60.05,106.32 60.45,106.72
  Top 0.254: PCB2.34 102.87,101.92 102.87,115.25 61.17,115.25 60.45,114.53 60.45,106.72
RST_3  (via drill 0.35)
  Top 0.2: v38.43,81.92 45.03,81.92 48.63,78.32 v48.63,74.52
  Bottom 0.2: M3.5 35.88,81.92 v38.43,81.92
  Bottom 0.305: PCB2.5 79.06,57.47 79.06,71.12 54.03,71.12 50.63,74.52 v48.63,74.52
RST_4  (via drill 0.35)
  Top 0.254: PCB2.25 88.9,108.27 76.79,108.27 75.84,107.32 v75.84,83.3
  Bottom 0.2: v75.84,83.3 55.04,83.3 M4.5
SCK
  Top 0.305: U2.D13 23.18,40.96 23.81,41.59 56.3,41.59 70.59,56.2 85.09,56.2 85.41,56.51 87.95,58.74 102.23,58.74 106.68,63.18 PCB2.SCK
SLP_1
  Top 0.2: M1.6 33.03,110.79 33.03,116.52 34.31,117.79 63.84,117.79
  Top 0.254: PCB2.38 107.95,101.92 107.95,117.79 63.84,117.79
SLP_2
  Top 0.2: 59.41,109.22 58.91,108.72 55.43,108.72 M2.6
  Top 0.254: PCB2.37 104.14,115.89 60.41,115.89 59.41,114.9 59.41,109.22
SLP_3  (via drill 0.35)
  Top 0.2: v39.43,74.72 v39.43,66.12
  Bottom 0.2: M3.6 38.03,85.72 39.43,84.32 v39.43,74.72
  Bottom 0.305: PCB2.6 78.11,54.93 78.11,65.12 40.43,65.12 v39.43,66.12
SLP_4  (via drill 0.35)
  Top 0.254: PCB2.22 87.63,101.92 87.63,107.63 78.55,107.63 77.47,106.55 v77.47,85.76
  Bottom 0.2: v77.47,85.76 54.96,85.76 M4.6
SS
  Top 0.254: PCB2.53 125.73,101.92 125.73,99.38
  Top 0.305: 125.73,99.38 125.73,76.52 91.12,43.18 83.88,43.18 | U2.D10 32.7,33.34 37.78,38.42 57.63,38.42 62.39,43.18 83.76,43.18
  Top 0.406: 83.76,43.18 PCB2.10 83.88,43.18
STP_1  (via drill 0.35)
  Top 0.2: 115.57,121.6 51.69,121.6 v51.63,121.55
  Top 0.254: PCB2.44 115.57,101.92 115.57,121.6
  Bottom 0.2: M1.7 40.01,117.17 44.78,117.17 47.53,119.92 50.2,119.92 51.63,121.35 v51.63,121.55 | R7.2 139.7,18.42
  Bottom 0.305: PCB2.44 116.2,98.74 128.27,98.74 129.54,99.69 134.62,99.69 140.97,93.35 140.97,24.13 141.6,23.49 141.6,20.32 139.7,18.42
STP_2  (via drill 0.35)
  Top 0.2: v66.04,109.92 68.2,112.08 73.03,112.08
  Top 0.254: PCB2.31 96.52,112.08 73.03,112.08
  Bottom 0.2: M2.7 64.19,111.76 v66.04,109.92
  Bottom 0.305: PCB2.31 98.43,105.09 130.17,105.09 141.6,93.66 141.6,24.45 142.24,23.81 142.24,20 141.6,19.37 141.6,8.57 140.33,7.3 128.4,7.3 R9.2
STP_3  (via drill 0.35)
  Top 0.2: 29.51,122.24 29.51,95.1 v30.91,93.7 | M3.7 36.98,88.27 42.63,93.92 47.43,93.92 52.03,89.32 52.03,60.72 v54.03,58.72
  Top 0.254: PCB2.47 116.84,122.24 29.51,122.24
  Bottom 0.2: v30.91,93.7 30.93,93.72 37.12,93.72 37.12,90.63 34.76,88.27 M3.7 | v54.03,58.72 54.03,58.56 71.76,58.56
  Bottom 0.305: 71.76,58.56 71.76,6.67 R6.2
STP_4
  Top 0.2: M4.7 53.49,88.27 52.89,88.87 52.89,91.97 53.43,92.52 68.06,92.52
  Top 0.254: PCB2.28 95.25,101.92 95.25,111.44 68.96,111.44 68.06,110.54 68.06,92.52
  Bottom 0.305: PCB2.28 88.27,95.25 88.27,24.13 87.31,23.18 87.31,17.02 R8.1
VCC  (via drill 0.3, 0.35, 0.6)
  Top 0.5: v23.98,93.7 21.91,95.76 M1.16 20.51,96.52 18.51,98.52 C10.+ | M4.16 42.37,72.89 | C8.+ v23.44,67.12 | M2.16 49.68,96.52 51.94,94.26 58.5,94.26 C9.+ | C11.+ 46.05,67.72 46.04,67.71
  Top 0.508: v90.61,49.97 v70.29,49.97 | 42.37,72.89 42.37,67.08 44.89,64.55 | U$5.P$3 44.89,62.32 | 44.89,62.32 44.89,64.55 | 44.89,64.55 44.89,66.56 46.04,67.71 50.06,71.73 50.06,87.09 45.84,91.32 45.23,91.32 v44.84,90.92 | v23.44,67.12 28.24,62.32 44.89,62.32
  Top 0.61: U$5.P$3 44.89,53.76 | C1.2 50.57,53.25 52.07,51.75 52.07,49.97 v52.15,49.97
  Top 0.813: 44.89,53.76 C1.2
  Bottom 0.25: PCB2.VIN 109.56,52.39
  Bottom 0.5: v23.98,93.7 23.98,75.09 M3.16 23.44,71.5 | v90.61,49.97 93.16,52.52 109.44,52.52 109.56,52.39 | v70.29,49.97 70.29,26.79 U2.VIN
  Bottom 0.508: v44.84,90.92 44.84,93.91 M2.16 | 23.44,71.5 v23.44,67.12
  Bottom 0.61: v70.29,49.97 v52.15,49.97
VIN
  Top 0.61: U$5.P$1 39.81,53.7
  Top 0.813: 39.81,53.7 C2.1
  Bottom 1.27: 31.43,59.56 31.75,59.56 39.62,59.56 U$5.P$1
  Bottom 2.159: PWR.1 31.43,59.56
  Bottom 2.54: U$6.SWITCH$1 160.27,10.1 158.11,7.3 147.95,7.3 142.24,1.59 67.95,1.59 62.86,6.03 62.86,22.54 58.42,22.54 58.42,44.45 35.06,44.45 31.75,48.11 31.75,59.56

### Text on the board
bPlace: VIN | GND
tNames: G | 1 | 2 | 3 | 4 | 12 | OpenStage | LCD | LCD | LCD header | GND | CH 1 | CH 1 | CH 2 | EN | CH 2 | CH 3 | CH 4 | CH 3 | CH 4 | LCD | LCD | 2 | Serial Comms | CH4 | CH3 | CH2 | CH1 | 1 | OFF | ON
bNames: CASE | CASE | CASE | 5k or 10k / trim pot. | contrast | GND | 4.25A max | GND | DIR1 | DIR2 | DIR3 | DIR4 | Pin12 | +12 to 32V | - | Jump to bypass R1 | MOTOR OUTPUTS | CASE | CASE | CASE | Arduino Mega 2560 / (plug in this side facing inwards) | 9V switching regulator | +9V | CASE | Serial Comms | OpenStage v3 / 4 axis microscope stage controller / Rob Campbell, 2014 | USB Host Shield / (plug in this side facing outwards) | CASE | CASE | CASE